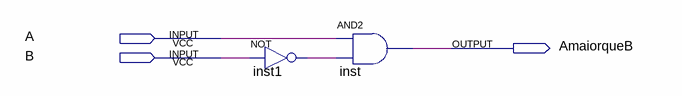
[diagram p0: schematic sheet]
// Quartus schematic blocoAmaiorqueB.bdf as structural Verilog: 2 symbols, 3 pins
module blocoAmaiorqueB (
  input  A,
  input  B,
  output AmaiorqueB
);

  wire inst1_out;

  not inst1 (inst1_out, B);
  and inst (AmaiorqueB, A, inst1_out);
endmodule
